# EAGLE schematic STorM32 NT splitter v001 (EAGLE 6.5.0)
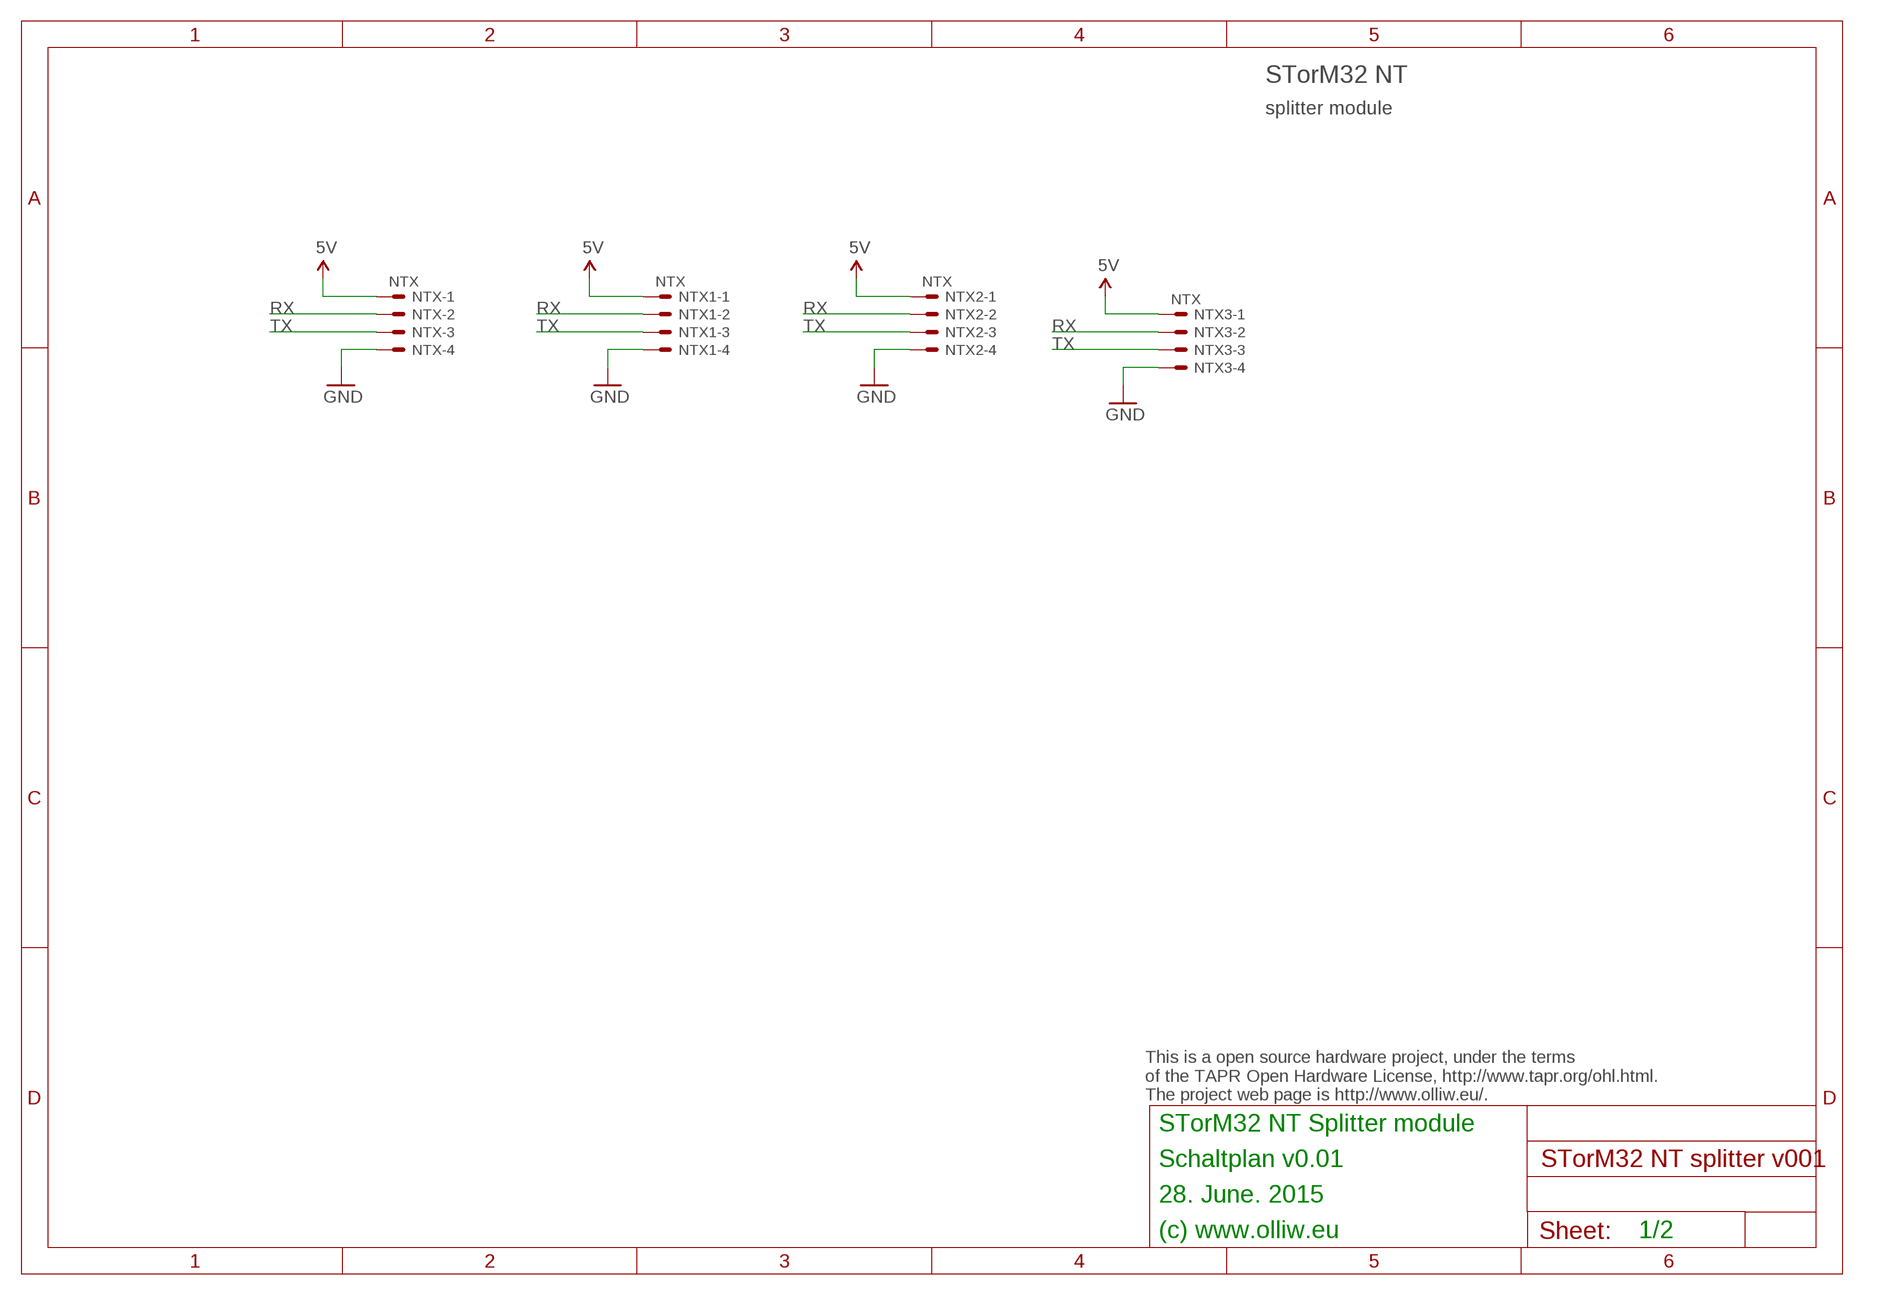
[diagram p0: schematic, sheet 1]

## Parts
NTX  NTX  SM04B-SRSS-TB  [SM04B-SRSS-TB]
NTX1  NTX  SM04B-SRSS-TB  [SM04B-SRSS-TB]
NTX2  NTX  SM04B-SRSS-TB  [SM04B-SRSS-TB]
NTX3  NTX  SM04B-SRSS-TB  [SM04B-SRSS-TB]

## Nets
5V: NTX1.1 NTX2.1 NTX3.1 NTX.1
GND: NTX1.4 NTX2.4 NTX3.4 NTX.4
RX: NTX1.2 NTX2.2 NTX3.2 NTX.2
TX: NTX1.3 NTX2.3 NTX3.3 NTX.3

## Notes on the sheet
- STorM32 NT
- splitter module
- This is a open source hardware project, under the terms
  of the TAPR Open Hardware License, http://www.tapr.org/ohl.html.
  The project web page is http://www.olliw.eu/.
- STorM32 NT Splitter module
- Schaltplan v0.01
- 28. June. 2015
- (c) www.olliw.eu | 1/2

## Library data of the parts
NTX NTX1-NTX3 = con-jst2:?M04B-SRSS-TB: Disconnectable Crimp style connector, 1.0mm pitch 4 contacts